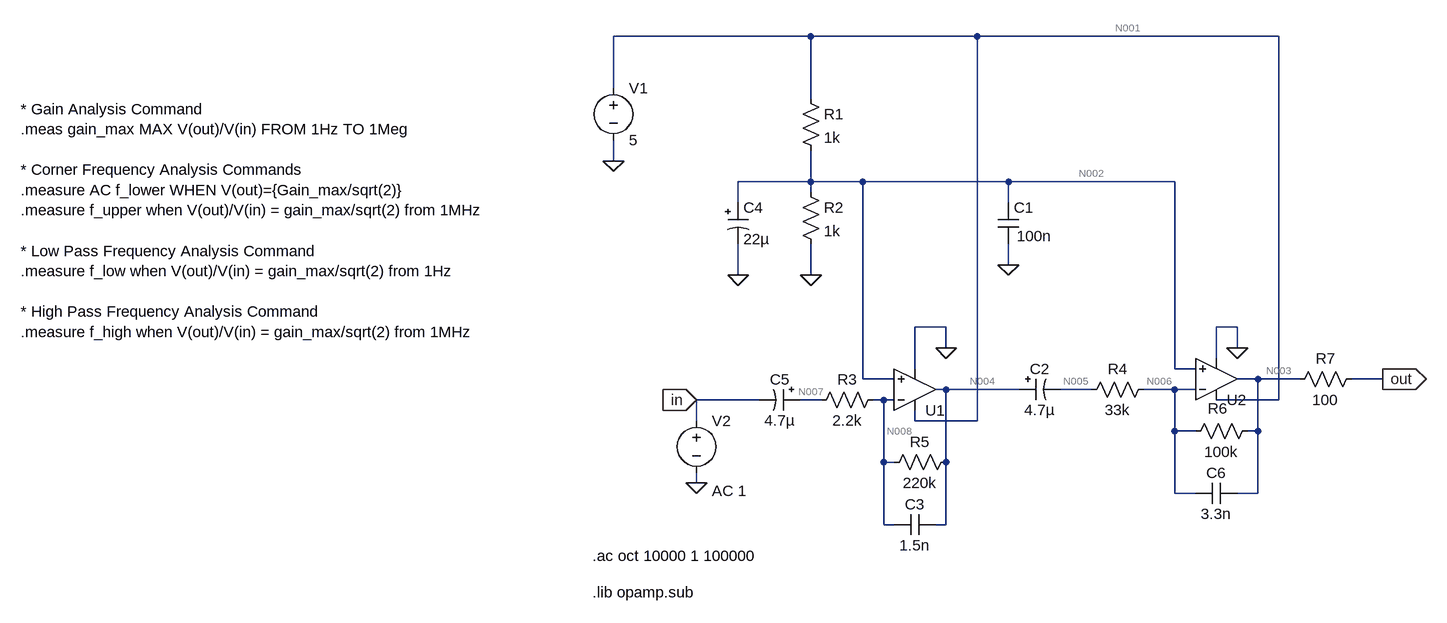
[diagram p0: schematic sdhd_lab.asc]
sdhd_lab.asc, the LTspice schematic file:
Version 4
SHEET 1 880 680
WIRE -192 -240 -496 -240
WIRE 64 -240 -192 -240
WIRE 528 -240 64 -240
WIRE -496 -160 -496 -240
WIRE -192 -144 -192 -240
WIRE -496 -48 -496 -80
WIRE -192 -16 -192 -64
WIRE -192 -16 -304 -16
WIRE -112 -16 -192 -16
WIRE 112 -16 -112 -16
WIRE 368 -16 112 -16
WIRE -192 0 -192 -16
WIRE -304 16 -304 -16
WIRE 112 16 112 -16
WIRE 112 112 112 80
WIRE -304 128 -304 80
WIRE -192 128 -192 80
WIRE 16 208 -32 208
WIRE 464 208 432 208
WIRE 16 240 16 208
WIRE 464 240 464 208
WIRE 432 256 432 208
WIRE -32 272 -32 208
WIRE 368 272 368 -16
WIRE 400 272 368 272
WIRE -112 288 -112 -16
WIRE -64 288 -112 288
WIRE 496 288 464 288
WIRE 560 288 496 288
WIRE 688 288 640 288
WIRE 16 304 0 304
WIRE 128 304 16 304
WIRE 240 304 192 304
WIRE 368 304 320 304
WIRE 400 304 368 304
WIRE -272 320 -368 320
WIRE -176 320 -208 320
WIRE -80 320 -96 320
WIRE -64 320 -80 320
WIRE 528 320 528 -240
WIRE 528 320 432 320
WIRE -368 352 -368 320
WIRE -32 352 -32 336
WIRE 64 352 64 -240
WIRE 64 352 -32 352
WIRE 368 368 368 304
WIRE 400 368 368 368
WIRE 496 368 496 288
WIRE 496 368 480 368
WIRE -80 416 -80 320
WIRE -64 416 -80 416
WIRE 16 416 16 304
WIRE -368 448 -368 432
WIRE 368 464 368 368
WIRE 400 464 368 464
WIRE 496 464 496 368
WIRE 496 464 464 464
WIRE -80 512 -80 416
WIRE -64 512 -80 512
WIRE 16 512 16 416
WIRE 16 512 0 512
FLAG -192 128 0
FLAG -304 128 0
FLAG 112 112 0
FLAG 688 288 out
IOPIN 688 288 Out
FLAG -496 -48 0
FLAG 16 240 0
FLAG 464 240 0
FLAG -368 448 0
FLAG -368 320 in
IOPIN -368 320 In
SYMBOL OpAmps\\UniversalOpAmp -32 304 M180
SYMATTR InstName U1
SYMBOL res -208 -160 R0
SYMATTR InstName R1
SYMATTR Value 1k
SYMBOL res -208 -16 R0
SYMATTR InstName R2
SYMATTR Value 1k
SYMBOL res -80 304 R90
WINDOW 0 0 56 VBottom 2
WINDOW 3 32 56 VTop 2
SYMATTR InstName R3
SYMATTR Value 2.2k
SYMBOL cap 96 16 R0
WINDOW 3 29 52 Left 2
SYMATTR Value 100n
SYMATTR InstName C1
SYMBOL polcap -320 16 R0
SYMATTR InstName C4
SYMATTR Value 22µ
SYMBOL polcap -208 304 R90
WINDOW 0 0 32 VBottom 2
WINDOW 3 32 32 VTop 2
SYMATTR InstName C5
SYMATTR Value 4.7µ
SYMBOL polcap 128 288 M90
WINDOW 0 0 32 VBottom 2
WINDOW 3 32 32 VTop 2
SYMATTR InstName C2
SYMATTR Value 4.7µ
SYMBOL res 336 288 R90
WINDOW 0 0 56 VBottom 2
WINDOW 3 32 56 VTop 2
SYMATTR InstName R4
SYMATTR Value 33k
SYMBOL res 32 400 R90
WINDOW 0 0 56 VBottom 2
WINDOW 3 32 56 VTop 2
SYMATTR InstName R5
SYMATTR Value 220k
SYMBOL res 496 352 R90
WINDOW 0 -3 62 VBottom 2
WINDOW 3 32 56 VTop 2
SYMATTR InstName R6
SYMATTR Value 100k
SYMBOL res 656 272 R90
WINDOW 0 0 56 VBottom 2
WINDOW 3 32 56 VTop 2
SYMATTR InstName R7
SYMATTR Value 100
SYMBOL OpAmps\\UniversalOpAmp 432 288 M180
SYMATTR InstName U2
SYMBOL cap 0 496 R90
WINDOW 0 0 32 VBottom 2
WINDOW 3 32 32 VTop 2
SYMATTR InstName C3
SYMATTR Value 1.5n
SYMBOL cap 464 448 R90
WINDOW 0 0 32 VBottom 2
WINDOW 3 32 32 VTop 2
SYMATTR InstName C6
SYMATTR Value 3.3n
SYMBOL voltage -496 -176 R0
WINDOW 123 0 0 Left 0
WINDOW 39 0 0 Left 0
SYMATTR InstName V1
SYMATTR Value 5
SYMBOL voltage -368 336 R0
WINDOW 123 24 124 Left 2
WINDOW 39 0 0 Left 0
SYMATTR Value2 AC 1
SYMATTR InstName V2
SYMATTR Value ""
TEXT -528 560 Left 2 !.ac oct 10000 1 100000
TEXT -1408 -128 Left 2 !* Gain Analysis Command\n.meas gain_max MAX V(out)/V(in) FROM 1Hz TO 1Meg\n \n* Corner Frequency Analysis Commands\n.measure AC f_lower WHEN V(out)={Gain_max/sqrt(2)}\n.measure f_upper when V(out)/V(in) = gain_max/sqrt(2) from 1MHz\n \n* Low Pass Frequency Analysis Command\n.measure f_low when V(out)/V(in) = gain_max/sqrt(2) from 1Hz\n \n* High Pass Frequency Analysis Command\n.measure f_high when V(out)/V(in) = gain_max/sqrt(2) from 1MHz
TEXT -528 616 Left 2 !.lib opamp.sub

The netlist it stands for:
* sdhd_lab.asc
XU1 N002 N008 N001 0 N004 level1 Avol=1Meg GBW=10Meg Vos=0 En=0 Enk=0 In=0 Ink=0 Rin=500Meg  ; pins In+ In- V+ V- OUT
R1 N001 N002 1k
R2 N002 0 1k
R3 N008 N007 2.2k
C1 N002 0 100n
C4 N002 0 22µ
C5 N007 in 4.7µ
C2 N004 N005 4.7µ
R4 N006 N005 33k
R5 N004 N008 220k
R6 N003 N006 100k
R7 out N003 100
XU2 N002 N006 N001 0 N003 level1 Avol=1Meg GBW=10Meg Vos=0 En=0 Enk=0 In=0 Ink=0 Rin=500Meg  ; pins In+ In- V+ V- OUT
C3 N004 N008 1.5n
C6 N003 N006 3.3n
V1 N001 0 5
V2 in 0 AC 1
.ac oct 10000 1 100000
* Gain Analysis Command
.meas gain_max MAX V(out)/V(in) FROM 1Hz TO 1Meg
* Corner Frequency Analysis Commands
.measure AC f_lower WHEN V(out)={Gain_max/sqrt(2)}
.measure f_upper when V(out)/V(in) = gain_max/sqrt(2) from 1MHz
* Low Pass Frequency Analysis Command
.measure f_low when V(out)/V(in) = gain_max/sqrt(2) from 1Hz
* High Pass Frequency Analysis Command
.measure f_high when V(out)/V(in) = gain_max/sqrt(2) from 1MHz
.lib opamp.sub
.lib UniversalOpAmp1.lib
.backanno
.end

* Results of the author's LTspice run, read from the files saved beside the schematic
* Operating Point, zero values left out:
*   V(n008) = 2.5 V
*   V(n002) = 2.5 V
*   V(n004) = 2.5 V
*   V(n001) = 5 V
*   V(n007) = 2.5 V
*   V(n005) = 2.5 V
*   V(n006) = 2.5 V
*   V(n003) = 2.5 V
*   V(out) = 2.5 V
*   I(R1) = 2.5 mA
*   I(R2) = 2.5 mA
*   I(V1) = -2.5 mA
*   Ix(u1:3) = 5 nA
*   Ix(u1:4) = -5 nA
*   Ix(u1:5) = -2.794 nA
*   Ix(u2:3) = 5 nA
*   Ix(u2:4) = -5 nA
*   Ix(u2:5) = 1.863 nA
* From the log:
*   gain_max: MAX(v(out)/v(in))=(49.2428dB,-4.15614°) FROM 1 TO 1e+06
*   f_lower: v(out)=(gain_max/sqrt(2)) AT 21.3446